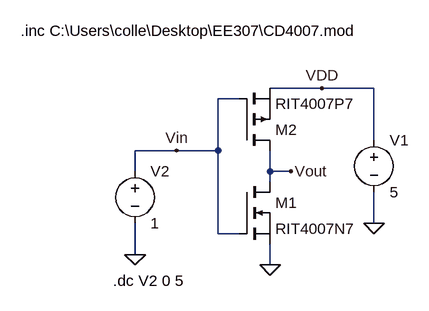
[diagram p0: schematic EE307_Hw2.asc]
EE307_Hw2.asc, the LTspice schematic file:
Version 4
SHEET 1 1096 680
WIRE 224 -48 144 -48
WIRE 304 -48 224 -48
WIRE 96 -32 64 -32
WIRE 304 32 304 -48
WIRE 0 48 -64 48
WIRE 64 48 64 -32
WIRE 64 48 0 48
WIRE -64 80 -64 48
WIRE 144 80 144 48
WIRE 176 80 144 80
WIRE 144 96 144 80
WIRE 304 160 304 112
WIRE 64 176 64 48
WIRE 96 176 64 176
WIRE -64 208 -64 160
WIRE 144 224 144 192
FLAG 144 224 0
FLAG -64 208 0
FLAG 304 160 0
FLAG 224 -48 VDD
FLAG 0 48 Vin
FLAG 176 80 Vout
SYMBOL nmos 96 96 R0
SYMATTR InstName M1
SYMATTR Value RIT4007N7
SYMBOL pmos 96 48 M180
SYMATTR InstName M2
SYMATTR Value RIT4007P7
SYMBOL voltage 304 16 R0
SYMATTR InstName V1
SYMATTR Value 5
SYMBOL voltage -64 64 R0
SYMATTR InstName V2
SYMATTR Value 1
TEXT -98 248 Left 2 !.dc V2 0 5
TEXT -240 -136 Left 2 !.inc C:\\Users\\colle\\Desktop\\EE307\\CD4007.mod

The netlist it stands for:
* EE307_Hw2.asc
M1 Vout Vin 0 0 RIT4007N7
M2 Vout Vin VDD VDD RIT4007P7
V1 VDD 0 5
V2 Vin 0 1
.model NMOS NMOS
.model PMOS PMOS
.lib standard.mos
.dc V2 0 5
.inc C:\Users\colle\Desktop\EE307\CD4007.mod
.backanno
.end